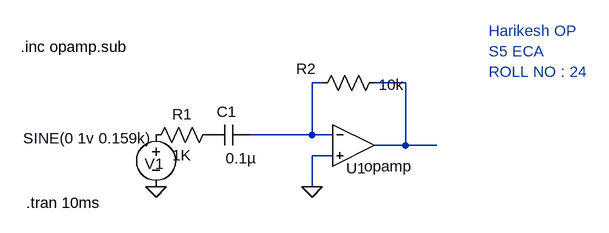
[diagram p0: schematic Draft3.asc]
Draft3.asc, the LTspice schematic file:
Version 4
SHEET 1 880 680
WIRE 256 96 240 96
WIRE 384 96 336 96
WIRE 240 176 240 96
WIRE 240 176 144 176
WIRE 272 176 240 176
WIRE 384 192 384 96
WIRE 384 192 336 192
WIRE 432 192 384 192
WIRE 272 208 240 208
WIRE 240 256 240 208
FLAG 240 256 0
FLAG 0 256 0
SYMBOL OpAmps\\opamp 304 128 R0
WINDOW 0 -11 99 Left 2
SYMATTR InstName U1
SYMBOL voltage 0 160 R0
WINDOW 123 0 0 Left 0
WINDOW 39 0 0 Left 0
WINDOW 0 -17 60 Left 2
WINDOW 3 -204 21 Left 2
SYMATTR InstName V1
SYMATTR Value SINE(0 1v 0.159k)
SYMBOL res 96 160 R90
WINDOW 0 0 56 VBottom 2
WINDOW 3 32 56 VTop 2
SYMATTR InstName R1
SYMATTR Value 1K
SYMBOL cap 144 160 R90
WINDOW 0 -4 35 VBottom 2
WINDOW 3 36 13 VTop 2
SYMATTR InstName C1
SYMATTR Value 0.1µ
SYMBOL res 352 80 R90
WINDOW 0 10 121 VBottom 2
WINDOW 3 3 -10 VTop 2
SYMATTR InstName R2
SYMATTR Value 10k
TEXT -208 40 Left 2 !.inc opamp.sub
TEXT 512 16 Left 2 ;Harikesh OP\nS5 ECA \nROLL NO : 24
TEXT -200 280 Left 2 !.tran 10ms

The netlist it stands for:
* Draft3.asc
XU1 N001 0 N002 opamp Aol=100K GBW=10Meg  ; pins invin noninvin out
V1 P001 0 SINE(0 1v 0.159k)
R1 P002 P001 1K
C1 N001 P002 0.1µ
R2 N002 N001 10k
.inc opamp.sub
* Harikesh OP
* S5 ECA
* ROLL NO : 24
.tran 10ms
.backanno
.end